# Altium schematic sheet bridge_rx.SchDoc
size 431 x 279 mm; SheetNumber: 2; SheetTotal: 9
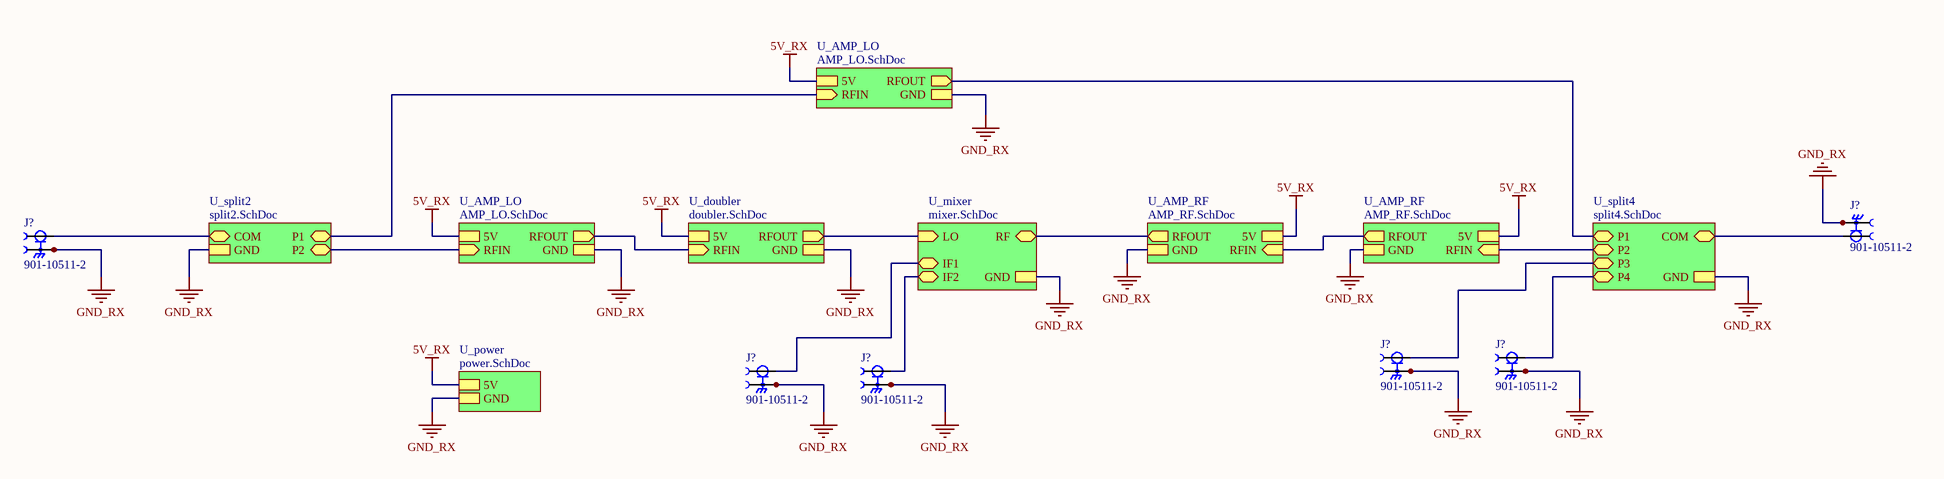
[diagram p0: bridge_rx.SchDoc]

## Parts
(Parts that share a designator on the sheet are numbered #1, #2 ... from top to bottom, then left to right.)
J?#1  901-10511-2  [AMPHENOL_901-10511-2]
J?#2  901-10511-2  [AMPHENOL_901-10511-2]
J?#3  901-10511-2  [AMPHENOL_901-10511-2]
J?#4  901-10511-2  [AMPHENOL_901-10511-2]
J?#5  901-10511-2  [AMPHENOL_901-10511-2]
J?#6  901-10511-2  [AMPHENOL_901-10511-2]

## Sub-sheets
U_AMP_LO = AMP_LO.SchDoc: GND, 5V, RFIN (in), RFOUT (out)
U_AMP_LO = AMP_LO.SchDoc: GND, 5V, RFIN (in), RFOUT (out)
U_AMP_RF = AMP_RF.SchDoc: 5V, RFIN (in), RFOUT (out), GND
U_AMP_RF = AMP_RF.SchDoc: 5V, RFIN (in), RFOUT (out), GND
U_doubler = doubler.SchDoc: RFOUT (out), RFIN (in), GND, 5V
U_mixer = mixer.SchDoc: RF (bidir), GND, LO (in), IF1 (bidir), IF2 (bidir)
U_power = power.SchDoc: 5V, GND
U_split2 = split2.SchDoc: COM (bidir), P1 (bidir), P2 (bidir), GND
U_split4 = split4.SchDoc: P1 (bidir), P2 (bidir), P3 (bidir), P4 (bidir), COM (bidir), GND

## Nets
5V_RX: sheet U_AMP_RF/5V, sheet U_AMP_LO/5V, sheet U_doubler/5V, sheet U_AMP_RF/5V, sheet U_power/5V, sheet U_AMP_LO/5V
GND_RX: J?#1.G1 J?#1.G2 J?#2.G1 J?#2.G2 J?#3.G1 J?#3.G2 J?#4.G1 J?#4.G2 J?#5.G1 J?#5.G2 J?#6.G1 J?#6.G2 ; sheet U_AMP_RF/GND, sheet U_AMP_LO/GND, sheet U_doubler/GND, sheet U_mixer/GND, sheet U_split4/GND, sheet U_AMP_RF/GND, sheet U_split2/GND, sheet U_power/GND, sheet U_AMP_LO/GND
NetJ?#1_1: J?#1.1 ; sheet U_split2/COM
NetJ?#2_1: J?#2.1 ; sheet U_split4/COM
NetJ?#3_1: J?#3.1 ; sheet U_split4/P3
NetJ?#4_1: J?#4.1 ; sheet U_split4/P4
NetJ?#5_1: J?#5.1 ; sheet U_mixer/IF1
NetJ?#6_1: J?#6.1 ; sheet U_mixer/IF2
(unnamed): sheet U_AMP_RF/RFIN, sheet U_split4/P2
(unnamed): sheet U_AMP_RF/RFOUT, sheet U_AMP_RF/RFIN
(unnamed): sheet U_AMP_LO/RFIN, sheet U_split2/P2
(unnamed): sheet U_AMP_LO/RFOUT, sheet U_doubler/RFIN
(unnamed): sheet U_doubler/RFOUT, sheet U_mixer/LO
(unnamed): sheet U_mixer/RF, sheet U_AMP_RF/RFOUT
(unnamed): sheet U_split4/P1, sheet U_AMP_LO/RFOUT
(unnamed): sheet U_split2/P1, sheet U_AMP_LO/RFIN

## Notes on the sheet
- DWG. NO.
- REV.
- SHT.
- THIS DOCUMENT AND THE DATA DISCLOSED HEREIN OR HEREWITH IS THE PROPERTY OF ALTIUM LIMITED AND MAY BE FREELY DISTRIBUTED IN WHOLE. NO RIGHTS ARE RESERVED OR EXPRESS OR IMPLIED WARANTEE GIVEN.
- REVISION
- DESCRIPTION
- DATE
- APPROVED
- ENG:
- APPROVALS
- PROJECT
- DSN:
- CHK:
- REFERENCE DOCUMENTS
- PROJECT REVISION:
- TITLE
- DOCUMENT REVISION:
- DESIGN ITEM:
- BOM:
- FAB DWG:
- PCB DWG:
- ASSY DWG:
- SCALE:
- SIZE
- B
- CAGE CODE
- FILE NAME
- DWG NO.
- SHEET
- OF
- REV

## Library data of the parts
J?#1-J?#6 = 901-10511-2: SMA Straight End Launch Jack, .010 Pin, .068  PCB, Edge-Mount, High Frequency | Amphenol RF 901-10511-2; SnapEDA_Link: https://www.snapeda.com/parts/901-10511-2/Amphenol+RF/view-part/?ref=snap; Package: None; Value: *; MF: Amphenol RF; MP: 901-10511-2; Check_prices: https://www.snapeda.com/parts/901-10511-2/Amphenol+RF/view-part/?ref=eda